# Altium schematic sheet spi-flash.SchDoc: SPI Serial Flash
size A4; Organization: Berne University of Applied Science; Address1: School of Engineering and; Address2: Information Technology; Address3: Quellgasse 21; Address4: CH-2501 Biel; Revision: 1.0; SheetNumber: 16; SheetTotal: 19; ApprovedBy: zem1; Author: zac1
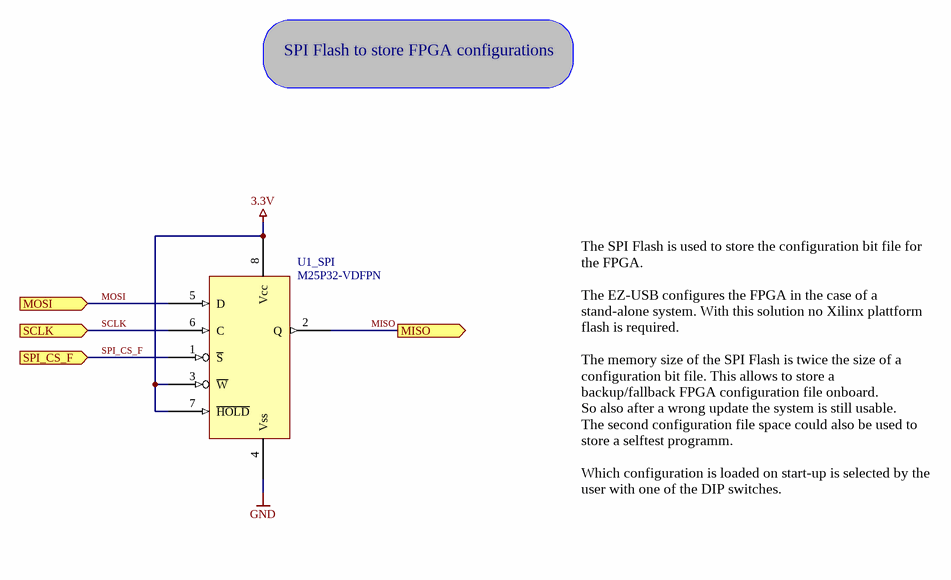
[diagram p0: spi-flash.SchDoc]

## Parts
U1_SPI  value M25P32-VDFPN  [VDFPN8]  (hidden comment: M25P32)

## Ports
MISO (out), MOSI (in), SCLK (in), SPI_CS_F (in)

## Nets
3.3V: U1_SPI.3(~{W}) U1_SPI.7(~{HOLD}) U1_SPI.8(Vcc)
GND: U1_SPI.4(Vss)
MISO: U1_SPI.2(Q) ; port MISO
MOSI: U1_SPI.5(D) ; port MOSI
SCLK: U1_SPI.6(C) ; port SCLK
SPI_CS_F: U1_SPI.1(~{S}) ; port SPI_CS_F

## Notes on the sheet
- SPI Flash to store FPGA configurations
- The SPI Flash is used to store the configuration bit file for the FPGA.
  The EZ-USB configures the FPGA in the case of a stand-alone system. With this solution no Xilinx plattform flash is required.
  The memory size of the SPI Flash is twice the size of a configuration bit file. This allows to store a backup/fallback FPGA configuration file onboard.
  So also after a wrong update the system is still usable.
  The second configuration file space could also be used to store a selftest programm.
  Which configuration is loaded on start-up is selected by the user with one of the DIP switches.
- Title:
- Size:
- Date:
- A4_L
- Author:
- Time:
- Revision:
- Sheet
- of
- File:

## Library data of the parts
U1_SPI = M25P32: Serial Flash Memory, Low Voltage, 50 MHz SPI Bus; Manufacturer: ST; Part Number: M25P32-VME6G; Currency: CHF; lead time: 12 Weeks; Packaging unit: 320; Prize: 6.92; Distributor: Silica; Distributor Number: M25P32VME6G; RoHS: yes